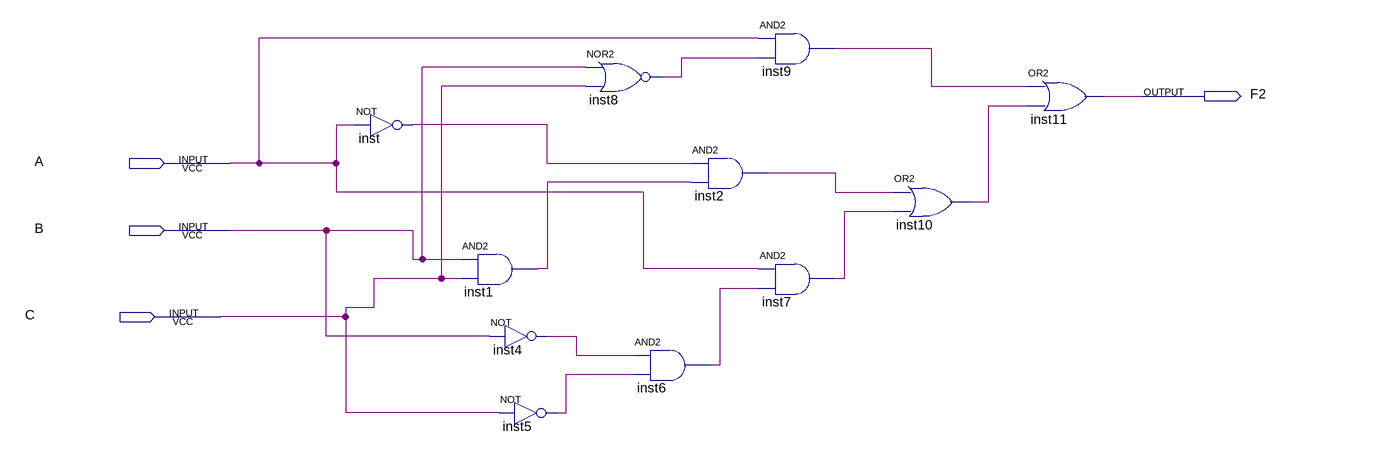
[diagram p0: schematic sheet]
// Quartus schematic F2.bdf as structural Verilog: 11 symbols, 4 pins
module F2 (
  input  A,
  input  B,
  input  C,
  output F2
);

  wire inst1_out, inst2_out, inst4_out, inst5_out, inst6_out, inst7_out, inst8_out, inst9_out, inst10_out,
       inst_out;

  not inst (inst_out, A);
  and inst1 (inst1_out, B, C);
  not inst4 (inst4_out, B);
  not inst5 (inst5_out, C);
  nor inst8 (inst8_out, B, C);
  and inst6 (inst6_out, inst4_out, inst5_out);
  and inst2 (inst2_out, inst_out, inst1_out);
  and inst9 (inst9_out, A, inst8_out);
  and inst7 (inst7_out, A, inst6_out);
  or inst10 (inst10_out, inst2_out, inst7_out);
  or inst11 (F2, inst9_out, inst10_out);
endmodule
